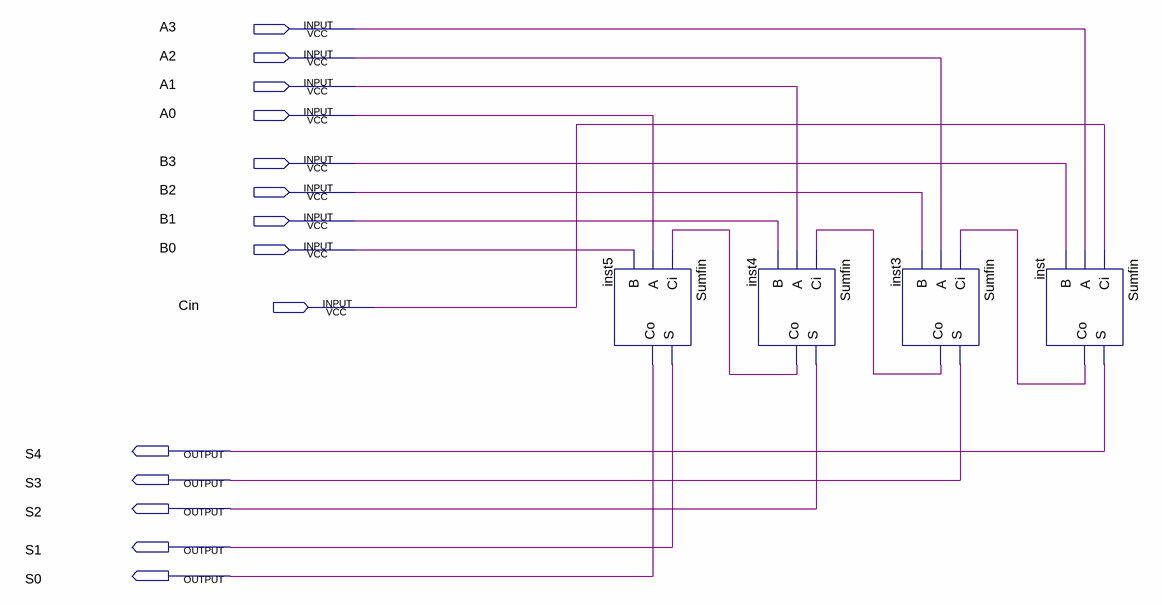
[diagram p0: schematic sheet]
// Quartus schematic SumV2.bdf as structural Verilog: 4 symbols, 14 pins
module SumV2 (
  input  A3,
  input  A2,
  input  A1,
  input  A0,
  input  B3,
  input  B2,
  input  B1,
  input  B0,
  input  Cin,
  output S4,
  output S3,
  output S2,
  output S1,
  output S0
);

  wire inst3_co, inst4_co, inst_co;

  Sumfin inst5 (.A(inst4_co), .B(A0), .Ci(B0), .S(S1), .Co(S0));
  Sumfin inst4 (.A(inst3_co), .B(A1), .Ci(B1), .S(S2), .Co(inst4_co));
  Sumfin inst3 (.A(inst_co), .B(A2), .Ci(B2), .S(S3), .Co(inst3_co));
  Sumfin inst (.A(Cin), .B(A3), .Ci(B3), .S(S4), .Co(inst_co));
endmodule
